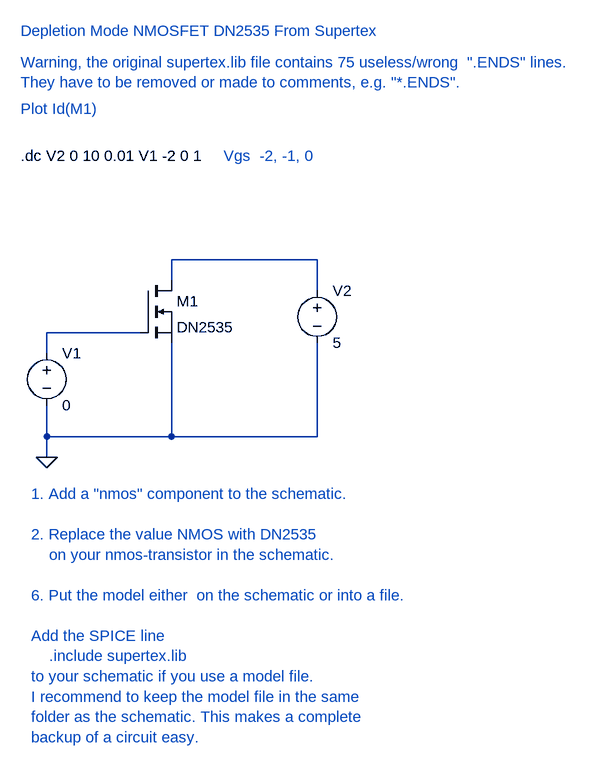
[diagram p0: schematic DN2535_test.asc]
DN2535_test.asc, the LTspice schematic file:
Version 4
SHEET 1 1512 988
WIRE -32 128 -256 128
WIRE -256 160 -256 128
WIRE -32 176 -32 128
WIRE -304 240 -448 240
WIRE -448 272 -448 240
WIRE -448 400 -448 352
WIRE -256 400 -256 256
WIRE -256 400 -448 400
WIRE -32 400 -32 256
WIRE -32 400 -256 400
WIRE -448 432 -448 400
FLAG -448 432 0
SYMBOL voltage -448 256 R0
SYMATTR InstName V1
SYMATTR Value 0
SYMBOL voltage -32 160 R0
SYMATTR InstName V2
SYMATTR Value 5
SYMBOL nmos -304 160 R0
SYMATTR InstName M1
SYMATTR Value DN2535
TEXT -488 -32 Left 0 !.dc V2 0 10 0.01 V1 -2 0 1
TEXT -472 488 Left 0 ;1. Add a "nmos" component to the schematic.\n \n2. Replace the value NMOS with DN2535\n    on your nmos-transistor in the schematic.\n \n6. Put the model either  on the schematic or into a file.\n \nAdd the SPICE line  \n    .include supertex.lib\nto your schematic if you use a model file. \nI recommend to keep the model file in the same \nfolder as the schematic. This makes a complete\nbackup of a circuit easy.
TEXT -176 -32 Left 0 ;Vgs  -2, -1, 0
TEXT -488 -104 Left 0 ;Plot Id(M1)
TEXT -488 -224 Left 0 ;Depletion Mode NMOSFET DN2535 From Supertex
TEXT -488 -176 Left 0 ;Warning, the original supertex.lib file contains 75 useless/wrong  ".ENDS" lines.\nThey have to be removed or made to comments, e.g. "*.ENDS".

The netlist it stands for:
* DN2535_test.asc
V1 N002 0 0
V2 N001 0 5
M1 N001 N002 0 0 DN2535
.model NMOS NMOS
.model PMOS PMOS
.lib standard.mos
.dc V2 0 10 0.01 V1 -2 0 1
* 1. Add a "nmos" component to the schematic.
* 2. Replace the value NMOS with DN2535
*     on your nmos-transistor in the schematic.
* 6. Put the model either  on the schematic or into a file.
* Add the SPICE line
*     .include supertex.lib
* to your schematic if you use a model file.
* I recommend to keep the model file in the same
* folder as the schematic. This makes a complete
* backup of a circuit easy.
* Vgs  -2, -1, 0
* Plot Id(M1)
* Depletion Mode NMOSFET DN2535 From Supertex
* Warning, the original supertex.lib file contains 75 useless/wrong  ".ENDS" lines.
* They have to be removed or made to comments, e.g. "*.ENDS".
.backanno
.end